# Altium project PCB_Project.PrjPcb
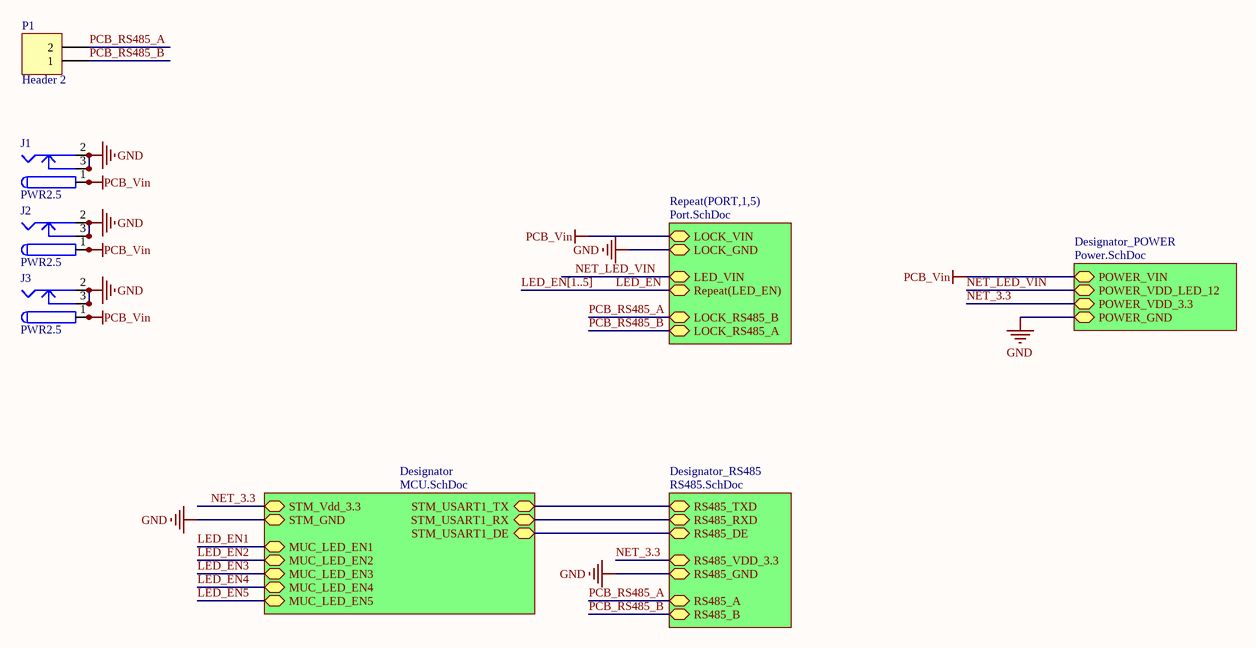
[diagram p0: Connect.SchDoc]
5 sheets, 120 parts. Net scope: strictly hierarchical (ports join the sheet entries above them; power ports are local).
Board file: PCB_CONNECT.PcbDoc
Sheets:
  Connect.SchDoc
    PORT1 = Port.SchDoc
    PORT2 = Port.SchDoc
    PORT3 = Port.SchDoc
    PORT4 = Port.SchDoc
    PORT5 = Port.SchDoc
    Designator_POWER = Power.SchDoc
    Designator_RS485 = RS485.SchDoc
    Designator = MCU.SchDoc

## Sheet Connect.SchDoc
size A4

### Parts
J1  PWR2.5  [KLD-0202]
J2  PWR2.5  [KLD-0202]
J3  PWR2.5  [KLD-0202]
P1  Header 2  [KF128-2P]

### Sub-sheets
Designator = MCU.SchDoc: STM_USART1_RX, STM_USART1_DE, STM_Vdd_3.3, STM_USART1_TX, STM_GND, MUC_LED_EN3, MUC_LED_EN2, MUC_LED_EN5, MUC_LED_EN1, MUC_LED_EN4
Designator_POWER = Power.SchDoc: POWER_GND, POWER_VDD_LED_12, POWER_VIN, POWER_VDD_3.3
Designator_RS485 = RS485.SchDoc: RS485_RXD, RS485_TXD, RS485_DE, RS485_VDD_3.3, RS485_B, RS485_GND, RS485_A
Repeat(PORT,1,5) = Port.SchDoc: LOCK_GND, Repeat(LED_EN), LOCK_RS485_B, LOCK_RS485_A, LOCK_VIN, LED_VIN

### Nets
GND: J1.2 J1.2A J1.2B J1.3 J1.3A J1.3B J2.2 J2.2A J2.2B J2.3 J2.3A J2.3B J3.2 J3.2A J3.2B J3.3 J3.3A J3.3B ; sheet Repeat(PORT,1,5)/LOCK_GND, sheet Designator_POWER/POWER_GND, sheet Designator_RS485/RS485_GND, sheet Designator/STM_GND  [project net Lock_GND]
NET_3.3: sheet Designator_POWER/POWER_VDD_3.3, sheet Designator_RS485/RS485_VDD_3.3, sheet Designator/STM_Vdd_3.3
NET_LED_VIN: sheet Repeat(PORT,1,5)/LED_VIN, sheet Designator_POWER/POWER_VDD_LED_12
PCB_Vin: J1.1 J1.1A J1.1B J2.1 J2.1A J2.1B J3.1 J3.1A J3.1B ; sheet Repeat(PORT,1,5)/LOCK_VIN, sheet Designator_POWER/POWER_VIN  [project net Lock_Vin]
DE: sheet Designator_RS485/RS485_DE, sheet Designator/STM_USART1_DE
LED_EN: sheet Repeat(PORT,1,5)/Repeat(LED_EN)
PCB_RS485_A: P1.2 ; sheet Repeat(PORT,1,5)/LOCK_RS485_B, sheet Designator_RS485/RS485_A  [project net Lock_RS485_B]
PCB_RS485_B: P1.1 ; sheet Repeat(PORT,1,5)/LOCK_RS485_A, sheet Designator_RS485/RS485_B  [project net Lock_RS485_A]
RXD: sheet Designator_RS485/RS485_RXD, sheet Designator/STM_USART1_RX
TXD: sheet Designator_RS485/RS485_TXD, sheet Designator/STM_USART1_TX

### Buses and harness runs
bus LED_EN[1..5]

### Library data of the parts
J1-J3 = PWR2.5: Low Voltage Power Supply Connector; Published: 17-Dec-2003; DatasheetDocument: 09-May-2002; Publisher: Altium Limited; ComponentLink1Description: Manufacturer Link; ComponentLink1URL: http://domino.kycon.com/internet/Products.html
P1 = Header 2: Header, 2-Pin; LatestRevisionDate: 17-Jul-2002; LatestRevisionNote: Re-released for DXP Platform.; Publisher: Altium Limited

## Sheet Port.SchDoc
size A4
Used 5 times, as channels PORT1, PORT2, PORT3, PORT4, PORT5. Parts and nets are listed once, with the designators drawn on the sheet.
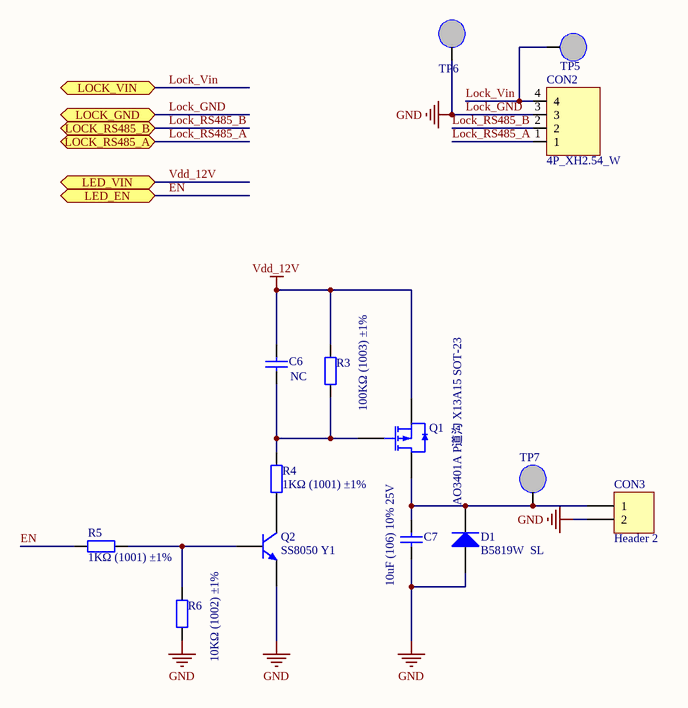
[diagram p1: Port.SchDoc]

### Parts
C6  NC  [0805_C]
C7  10uF (106) 10% 25V  [0805_C]
CON2  4P_XH2.54_W  [XH2.54-LS-4P]
CON3  Header 2  [PH2.0-LS-2P]
D1  B5819W  SL  [SOD-123]
Q1  AO3401A P道沟 X13A15 SOT-23  [SOT-23-3L]
Q2  SS8050 Y1  [SOT-23(SOT-23-3)]
R3  100KΩ (1003) ±1%  [0805_R]
R4  1KΩ (1001) ±1%  [0805_R]
R5  1KΩ (1001) ±1%  [0805_R]
R6  10KΩ (1002) ±1%  [0805_R]
TP5  TP  [TP]  (value not drawn)
TP6  TP  [TP]  (value not drawn)
TP7  TP  [TP]  (value not drawn)

### Ports
LED_EN, LED_VIN, LOCK_GND, LOCK_RS485_A, LOCK_RS485_B, LOCK_VIN

### Nets
Lock_GND: C7.1 CON2.3 CON3.2 D1.1(A) Q2.2(E) R6.1 TP6.1 ; port LOCK_GND  [also labelled GND]
Vdd_12V: C6.2 Q1.2(S) R3.2 ; port LED_VIN
EN: R5.1 ; port LED_EN
Lock_RS485_A: CON2.1 ; port LOCK_RS485_A
Lock_RS485_B: CON2.2 ; port LOCK_RS485_B
Lock_Vin: CON2.4 TP5.1 ; port LOCK_VIN
NetC6_1: C6.1 Q1.1(G) R3.1 R4.1
NetC7_2: C7.2 CON3.1 D1.2(K) Q1.3(D) TP7.1
NetQ2_1: Q2.1(B) R5.2 R6.2
NetQ2_3: Q2.3(C) R4.2

Not connected (* = marked no-connect by the designer): CON2 A B

### Channels
PORT1: designators end in _PORT1; ports LED_EN=EN LED_VIN=NET_LED_VIN LOCK_GND=Lock_GND LOCK_RS485_A=Lock_RS485_A LOCK_RS485_B=Lock_RS485_B LOCK_VIN=Lock_Vin
PORT2: designators end in _PORT2; ports LED_EN=EN LED_VIN=NET_LED_VIN LOCK_GND=Lock_GND LOCK_RS485_A=Lock_RS485_A LOCK_RS485_B=Lock_RS485_B LOCK_VIN=Lock_Vin
PORT3: designators end in _PORT3; ports LED_EN=EN LED_VIN=NET_LED_VIN LOCK_GND=Lock_GND LOCK_RS485_A=Lock_RS485_A LOCK_RS485_B=Lock_RS485_B LOCK_VIN=Lock_Vin
PORT4: designators end in _PORT4; ports LED_EN=EN LED_VIN=NET_LED_VIN LOCK_GND=Lock_GND LOCK_RS485_A=Lock_RS485_A LOCK_RS485_B=Lock_RS485_B LOCK_VIN=Lock_Vin
PORT5: designators end in _PORT5; ports LED_EN=EN LED_VIN=NET_LED_VIN LOCK_GND=Lock_GND LOCK_RS485_A=Lock_RS485_A LOCK_RS485_B=Lock_RS485_B LOCK_VIN=Lock_Vin

### Library data of the parts
C6 = 0805 22uF (226) 20% 25V: 贴片电容; ComponentLink1Description: 供应商链接; ComponentLink1URL: http://www.szlcsc.com/product/details_46786.html; Package: 0805; Supplier: LC; SuppliersPartNumber: C45783
C7 = 0805 10uF (106) 10% 25V: 贴片电容; ComponentLink1Description: 供应商链接; ComponentLink1URL: http://www.szlcsc.com/product/details_16532.html; Package: 0805; Supplier: LC; SuppliersPartNumber: C15850
CON3 = Header 2: Header, 2-Pin; LatestRevisionDate: 17-Jul-2002; LatestRevisionNote: Re-released for DXP Platform.; Publisher: Altium Limited
D1 = SOD-123 B5819W  SL: 肖特基二极管; ComponentLink1Description: 供应商链接; ComponentLink1URL: http://www.szlcsc.com/product/details_9093.html; Package: SOD-123; Supplier: LC; SuppliersPartNumber: C8598
Q1 = AO3401A P道沟 X13A15 SOT-23: MOS(场效应管); ComponentLink1Description: 供应商链接; ComponentLink1URL: http://www.szlcsc.com/product/details_15801.html; Package: SOT-23; Supplier: LC; SuppliersPartNumber: C15127
Q2 = SOT-23 SS8050 Y1: 三极管; ComponentLink1Description: 供应商链接; ComponentLink1URL: http://www.szlcsc.com/product/details_2507.html; Package: SOT-23; Supplier: LC; SuppliersPartNumber: C2150
R3 = 0805 100KΩ (1003) 1%: 贴片电阻; ComponentLink1Description: 供应商链接; ComponentLink1URL: http://www.szlcsc.com/product/details_18095.html; Package: 0805; Supplier: LC; SuppliersPartNumber: C17407
R4 R5 = 0805 1KΩ (1001) 1%: 贴片电阻; ComponentLink1Description: 供应商链接; ComponentLink1URL: http://www.szlcsc.com/product/details_18201.html; Package: 0805; Supplier: LC; SuppliersPartNumber: C17513
R6 = 0805 10KΩ (1002) 1%: 贴片电阻; ComponentLink1Description: 供应商链接; ComponentLink1URL: http://www.szlcsc.com/product/details_18102.html; Package: 0805; Supplier: LC; SuppliersPartNumber: C17414

## Sheet Power.SchDoc
size A4
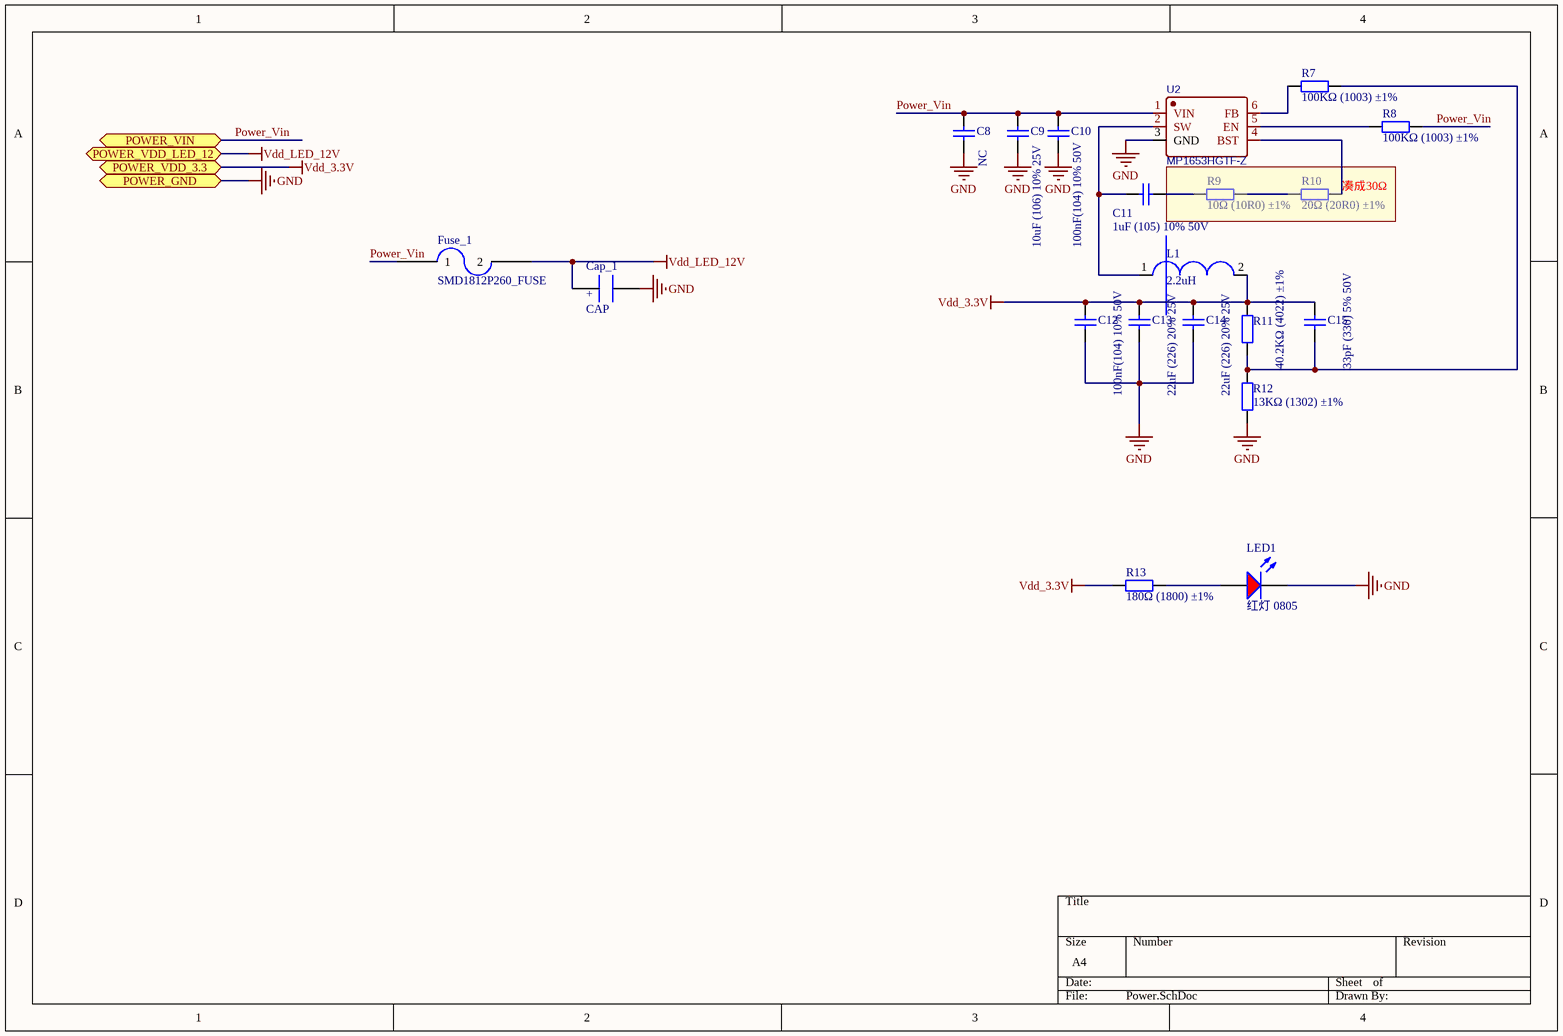
[diagram p2: Power.SchDoc]

### Parts
C8  NC  [0805_C]
C9  10uF (106) 10% 25V  [0805_C]
C10  100nF(104) 10% 50V  [0805_C]
C11  1uF (105) 10% 50V  [0805_C]
C12  100nF(104) 10% 50V  [0805_C]
C13  22uF (226) 20% 25V  [0805_C]
C14  22uF (226) 20% 25V  [0805_C]
C15  33pF (330) 5% 50V  [0805_C]
Cap_1  CAP  [8X12_CAP]
Fuse_1  SMD1812P260_FUSE  [SMD1812P260]
L1  2.2uH  [L_4030]
LED1  红灯 0805  [0805_LED_S1]
R7  100KΩ (1003) ±1%  [0805_R]
R8  100KΩ (1003) ±1%  [0805_R]
R9  10Ω (10R0) ±1%  [0805_R]
R10  20Ω (20R0) ±1%  [0805_R]
R11  40.2KΩ (4022) ±1%  [0805_R]
R12  13KΩ (1302) ±1%  [0805_R]
R13  180Ω (1800) ±1%  [0805_R]
U2  MP1653HGTF-Z  [SOT563-6]

### Blocks framed on the sheet
凑成30Ω: R9 R10

### Ports
POWER_GND, POWER_VDD_3.3, POWER_VDD_LED_12, POWER_VIN

### Nets
GND: C8.1 C9.1 C10.1 C12.1 C13.1 C14.1 Cap_1.2 LED1.K R12.1 U2.3(GND) ; port POWER_GND  [project net Lock_GND]
Power_Vin: C8.2 C9.2 C10.2 Fuse_1.1 R8.2 U2.1(VIN) ; port POWER_VIN  [project net Lock_Vin]
Vdd_3.3V: C12.2 C13.2 C14.2 C15.2 L1.2 R11.1 R13.1 ; port POWER_VDD_3.3  [project net NET_3.3]
Vdd_LED_12V: Cap_1.1 Fuse_1.2 ; port POWER_VDD_LED_12  [project net NET_LED_VIN]
NetC11_1: C11.1 R9.2
NetC11_2: C11.2 L1.1 U2.2(SW)
NetC15_1: C15.1 R7.2 R11.2 R12.2
NetLED1_A: LED1.A R13.2
NetR7_1: R7.1 U2.6(FB)
NetR8_1: R8.1 U2.5(EN)
NetR9_1: R9.1 R10.2
NetR10_1: R10.1 U2.4(BST)

### Notes on the sheet
- (in symbol CAP) +

### Library data of the parts
C8 C9 = 0805 10uF (106) 10% 25V: 贴片电容; ComponentLink1Description: 供应商链接; ComponentLink1URL: http://www.szlcsc.com/product/details_16532.html; Package: 0805; Supplier: LC; SuppliersPartNumber: C15850
C10 C12 = 0805 100nF(104) 10% 50V: 贴片电容; ComponentLink1Description: 供应商链接; ComponentLink1URL: http://www.szlcsc.com/product/details_50686.html; Package: 0805; Supplier: LC; SuppliersPartNumber: C49678
C11 = 0805 1uF (105) 10% 50V: 贴片电容; ComponentLink1Description: 供应商链接; ComponentLink1URL: http://www.szlcsc.com/product/details_29074.html; Package: 0805; Supplier: LC; SuppliersPartNumber: C28323
C13 C14 = 0805 22uF (226) 20% 25V: 贴片电容; ComponentLink1Description: 供应商链接; ComponentLink1URL: http://www.szlcsc.com/product/details_46786.html; Package: 0805; Supplier: LC; SuppliersPartNumber: C45783
C15 = 0805 33pF (330) 5% 50V: 贴片电容; ComponentLink1Description: 供应商链接; ComponentLink1URL: http://www.szlcsc.com/product/details_2166.html; Package: 0805; Supplier: LC; SuppliersPartNumber: C1814
L1 = 33uH
LED1 = 0805 红灯: 发光二极管; ComponentLink1Description: 供应商链接; ComponentLink1URL: http://www.szlcsc.com/product/details_2668.html; Package: 0805; Supplier: LC; SuppliersPartNumber: C2295
R7 R8 = 0805 100KΩ (1003) 1%: 贴片电阻; ComponentLink1Description: 供应商链接; ComponentLink1URL: http://www.szlcsc.com/product/details_18095.html; Package: 0805; Supplier: LC; SuppliersPartNumber: C17407
R9 = 0805 10Ω (10R0) 1%: 贴片电阻; ComponentLink1Description: 供应商链接; ComponentLink1URL: http://www.szlcsc.com/product/details_18103.html; Package: 0805; Supplier: LC; SuppliersPartNumber: C17415
R10 = 0805 20Ω (20R0) 1%: 贴片电阻; ComponentLink1Description: 供应商链接; ComponentLink1URL: http://www.szlcsc.com/product/details_18232.html; Package: 0805; Supplier: LC; SuppliersPartNumber: C17544
R11 = 0805 40.2KΩ (4022) 1%: 贴片电阻; ComponentLink1Description: 供应商链接; ComponentLink1URL: http://www.szlcsc.com/product/details_18366.html; Package: 0805; Supplier: LC; SuppliersPartNumber: C17678
R12 = 0805 13KΩ (1302) 1%: 贴片电阻; ComponentLink1Description: 供应商链接; ComponentLink1URL: http://www.szlcsc.com/product/details_18143.html; Package: 0805; Supplier: LC; SuppliersPartNumber: C17455
R13 = 0805 180Ω (1800) 1%: 贴片电阻; ComponentLink1Description: 供应商链接; ComponentLink1URL: http://www.szlcsc.com/product/details_26013.html; Package: 0805; Supplier: LC; SuppliersPartNumber: C25270
U2 = MP1653HGTF-Z: BOM_Manufacturer: MPS; BOM_Supplier: LCSC; BOM_Manufacturer Part: MP1653HGTF-Z; BOM_Supplier Part: C132613; spicePre: U

## Sheet RS485.SchDoc
size A4
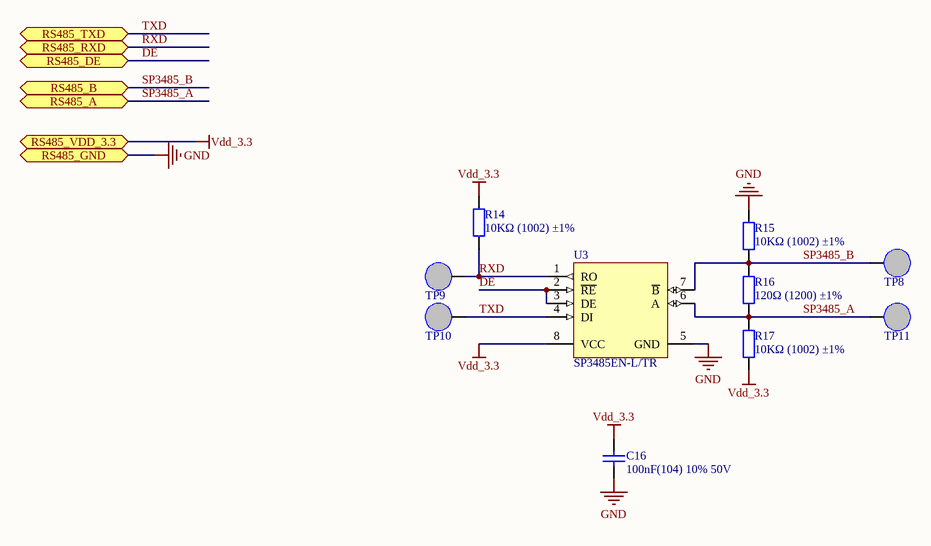
[diagram p3: RS485.SchDoc]

### Parts
C16  100nF(104) 10% 50V  [0805_C]
R14  10KΩ (1002) ±1%  [0805_R]
R15  10KΩ (1002) ±1%  [0805_R]
R16  120Ω (1200) ±1%  [0805_R]
R17  10KΩ (1002) ±1%  [0805_R]
TP8  TP  [TP]  (value not drawn)
TP9  TP  [TP]  (value not drawn)
TP10  TP  [TP]  (value not drawn)
TP11  TP  [TP]  (value not drawn)
U3  SP3485EN-L/TR  [SOIC-8_150mil]

### Ports
RS485_A, RS485_B, RS485_DE, RS485_GND, RS485_RXD, RS485_TXD, RS485_VDD_3.3

### Nets
GND: C16.2 R15.2 U3.5(GND) ; port RS485_GND  [project net Lock_GND]
Vdd_3.3: C16.1 R14.2 R17.1 U3.8(VCC) ; port RS485_VDD_3.3  [project net NET_3.3]
DE: U3.2(~{RE}) U3.3(DE) ; port RS485_DE
RXD: R14.1 TP9.1 U3.1(RO) ; port RS485_RXD
SP3485_A: R16.1 R17.2 TP11.1 U3.6(A) ; port RS485_A  [project net Lock_RS485_B]
SP3485_B: R15.1 R16.2 TP8.1 U3.7(~{B}) ; port RS485_B  [project net Lock_RS485_A]
TXD: TP10.1 U3.4(DI) ; port RS485_TXD

### Library data of the parts
C16 = 0805 100nF(104) 10% 50V: 贴片电容; ComponentLink1Description: 供应商链接; ComponentLink1URL: http://www.szlcsc.com/product/details_50686.html; Package: 0805; Supplier: LC; SuppliersPartNumber: C49678
R14 R15 R17 = 0805 10KΩ (1002) 1%: 贴片电阻; ComponentLink1Description: 供应商链接; ComponentLink1URL: http://www.szlcsc.com/product/details_18102.html; Package: 0805; Supplier: LC; SuppliersPartNumber: C17414
R16 = 0805 120Ω (1200) 1%: 贴片电阻; ComponentLink1Description: 供应商链接; ComponentLink1URL: http://www.szlcsc.com/product/details_18125.html; Package: 0805; Supplier: LC; SuppliersPartNumber: C17437
U3 = SP3485EN-L/TR_[C8963]: RS-485/RS-422; ComponentLink1Description: 供应商链接; ComponentLink1URL: http://www.szlcsc.com/product/details_9482.html; Package: SOIC-8; Supplier: LC; SuppliersPartNumber: C8963

## Sheet MCU.SchDoc
size A4
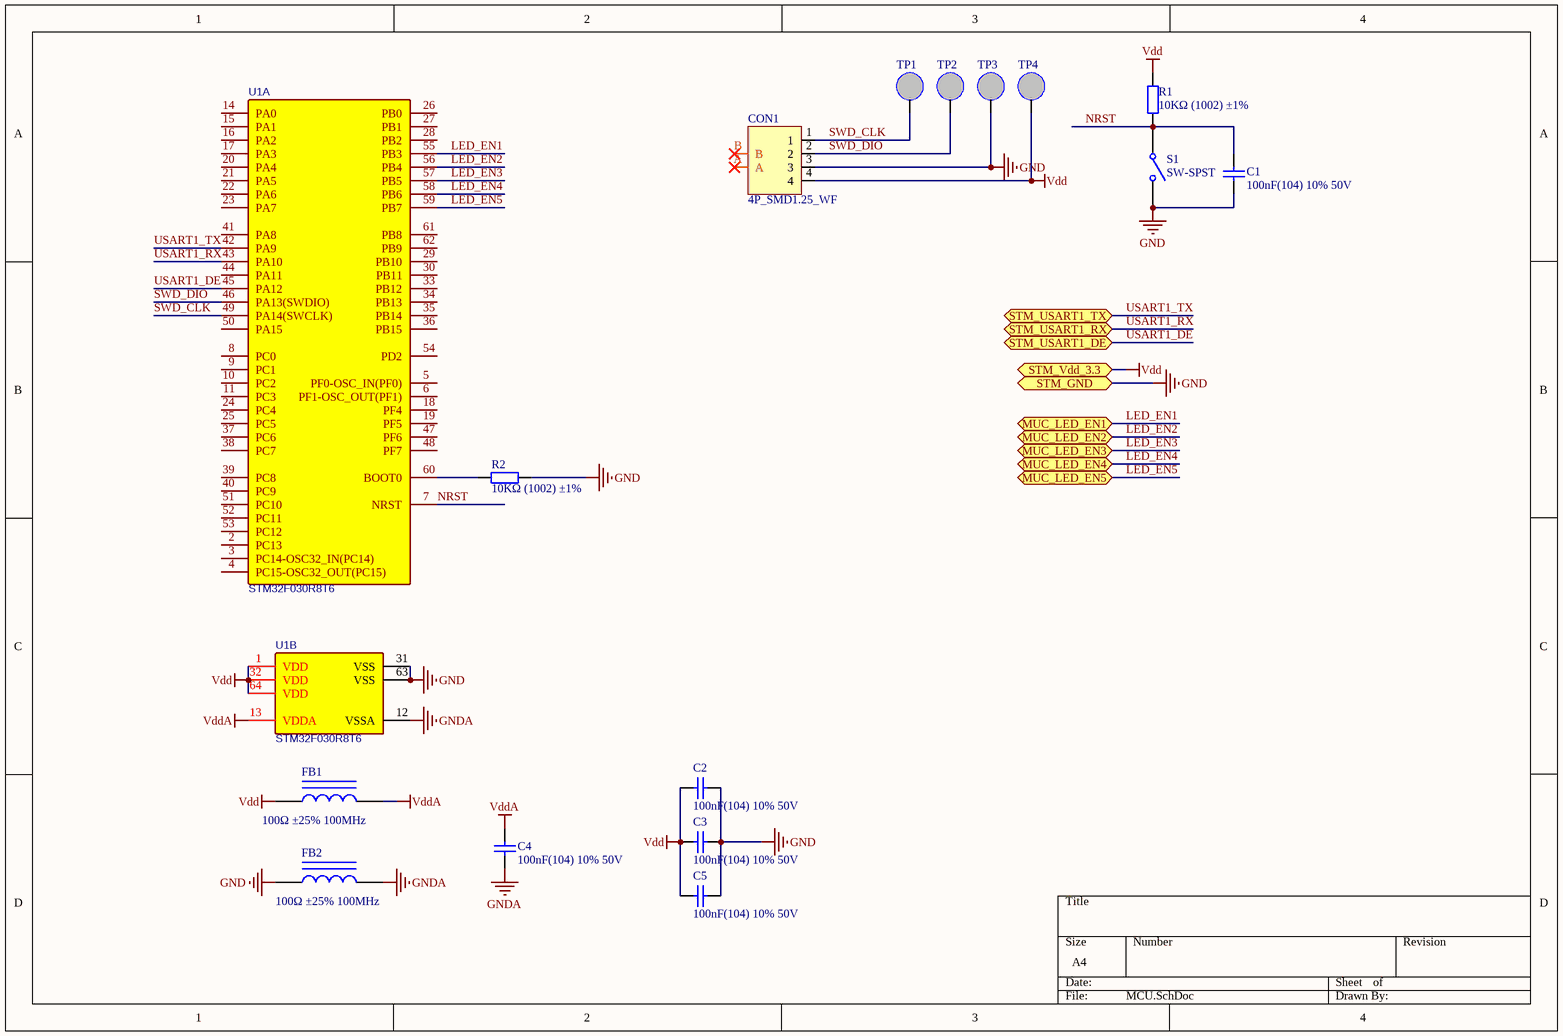
[diagram p4: MCU.SchDoc]

### Parts
C1  100nF(104) 10% 50V  [0805_C]
C2  100nF(104) 10% 50V  [0805_C]
C3  100nF(104) 10% 50V  [0805_C]
C4  100nF(104) 10% 50V  [0805_C]
C5  100nF(104) 10% 50V  [0805_C]
CON1  4P_SMD1.25_WF  [MX 1.25-LS-4P]
FB1  100Ω ±25% 100MHz  [0805_L]
FB2  100Ω ±25% 100MHz  [0805_L]
R1  10KΩ (1002) ±1%  [0805_R]
R2  10KΩ (1002) ±1%  [0805_R]
S1  SW-SPST  [key]
TP1  TP  [TP]  (value not drawn)
TP2  TP  [TP]  (value not drawn)
TP3  TP  [TP]  (value not drawn)
TP4  TP  [TP]  (value not drawn)
U1  STM32F030R8T6  [LQFP-64_10X10X05P]  (parts A,B of 2)

### Ports
MUC_LED_EN1, MUC_LED_EN2, MUC_LED_EN3, MUC_LED_EN4, MUC_LED_EN5, STM_GND, STM_USART1_DE, STM_USART1_RX, STM_USART1_TX, STM_Vdd_3.3

### Nets
GND: C1.1 C2.1 C3.1 C5.1 CON1.3 FB2.1 R2.2 S1.2(NO) TP3.1 U1.31(VSS) U1.63(VSS) ; port STM_GND  [project net Lock_GND]
GNDA: C4.1 FB2.2 U1.12(VSSA)
Vdd: C2.2 C3.2 C5.2 CON1.4 FB1.1 R1.2 TP4.1 U1.1(VDD) U1.32(VDD) U1.64(VDD) ; port STM_Vdd_3.3  [project net NET_3.3]
VddA: C4.2 FB1.2 U1.13(VDDA)
LED_EN1: U1.55(PB3) ; port MUC_LED_EN1  [project net EN]
LED_EN2: U1.56(PB4) ; port MUC_LED_EN2  [project net EN]
LED_EN3: U1.57(PB5) ; port MUC_LED_EN3  [project net EN]
LED_EN4: U1.58(PB6) ; port MUC_LED_EN4  [project net EN]
LED_EN5: U1.59(PB7) ; port MUC_LED_EN5  [project net EN]
NRST: C1.2 R1.1 S1.1(COMMON) U1.7(NRST)
SWD_CLK: CON1.1 TP1.1 U1.49(PA14(SWCLK))
SWD_DIO: CON1.2 TP2.1 U1.46(PA13(SWDIO))
USART1_DE: U1.45(PA12) ; port STM_USART1_DE  [project net DE]
USART1_RX: U1.43(PA10) ; port STM_USART1_RX  [project net RXD]
USART1_TX: U1.42(PA9) ; port STM_USART1_TX  [project net TXD]
NetR2_1: R2.1 U1.60(BOOT0)

Not connected (* = marked no-connect by the designer): CON1 A* B*; U1 2(PC13) 3(PC14-OSC32_IN(PC14)) 4(PC15-OSC32_OUT(PC15)) 5(PF0-OSC_IN(PF0)) 6(PF1-OSC_OUT(PF1)) 8(PC0) 9(PC1) 10(PC2) 11(PC3) 14(PA0) 15(PA1) 16(PA2) 17(PA3) 18(PF4) 19(PF5) 20(PA4) 21(PA5) 22(PA6) 23(PA7) 24(PC4) 25(PC5) 26(PB0) 27(PB1) 28(PB2) 29(PB10) 30(PB11) 33(PB12) 34(PB13) 35(PB14) 36(PB15) 37(PC6) 38(PC7) 39(PC8) 40(PC9) 41(PA8) 44(PA11) 47(PF6) 48(PF7) 50(PA15) 51(PC10) 52(PC11) 53(PC12) 54(PD2) 61(PB8) 62(PB9)

### Library data of the parts
C1-C5 = 0805 100nF(104) 10% 50V: 贴片电容; ComponentLink1Description: 供应商链接; ComponentLink1URL: http://www.szlcsc.com/product/details_50686.html; Package: 0805; Supplier: LC; SuppliersPartNumber: C49678
CON1 = 4P_XH2.54_W
FB1 FB2 = 0805 100Ω 25% 100MHz: 贴片磁珠; ComponentLink1Description: 供应商链接; ComponentLink1URL: http://www.szlcsc.com/product/details_1367.html; Package: 0805; Supplier: LC; SuppliersPartNumber: C1015
R1 R2 = 0805 10KΩ (1002) 1%: 贴片电阻; ComponentLink1Description: 供应商链接; ComponentLink1URL: http://www.szlcsc.com/product/details_18102.html; Package: 0805; Supplier: LC; SuppliersPartNumber: C17414
S1 = SW-SPST: Single-Pole, Single-Throw Switch; Published: 24-Mar-1999; LatestRevisionDate: 17-Jul-2002; LatestRevisionNote: Re-released for DXP Platform.; PackageReference: SPST-2; Publisher: Altium Limited; PackageDescription: Switch; 2 Leads
U1 = STM32F030R8T6: BOM_Manufacturer: ST; subpart_no: 1; tags: STM32; BOM_Supplier Part: C39105; BOM_Supplier: LCSC; BOM_Manufacturer Part: STM32F030R8T6; image: http://image.lceda.cn/szlcsc/C39105.jpg; spicePre: U

## Nets that join several sheets
Lock_GND: Connect (18 pins), PORT1 (7 pins), PORT2 (7 pins), PORT3 (7 pins), PORT4 (7 pins), PORT5 (7 pins), Power (10 pins), RS485 (C16.2 R15.2 U3.5), MCU (11 pins)
Lock_Vin: Connect (9 pins), PORT1 (CON2_PORT1.4 TP5_PORT1.1), PORT2 (CON2_PORT2.4 TP5_PORT2.1), PORT3 (CON2_PORT3.4 TP5_PORT3.1), PORT4 (CON2_PORT4.4 TP5_PORT4.1), PORT5 (CON2_PORT5.4 TP5_PORT5.1), Power (6 pins)
NET_3.3: Power (7 pins), RS485 (C16.1 R14.2 R17.1 U3.8), MCU (10 pins)
NET_LED_VIN: PORT1 (C6_PORT1.2 Q1_PORT1.2 R3_PORT1.2), PORT2 (C6_PORT2.2 Q1_PORT2.2 R3_PORT2.2), PORT3 (C6_PORT3.2 Q1_PORT3.2 R3_PORT3.2), PORT4 (C6_PORT4.2 Q1_PORT4.2 R3_PORT4.2), PORT5 (C6_PORT5.2 Q1_PORT5.2 R3_PORT5.2), Power (Cap_1.1 Fuse_1.2)
DE: RS485 (U3.2 U3.3), MCU (U1.45)
EN: PORT1 (R5_PORT1.1), MCU (U1.55)
EN: PORT2 (R5_PORT2.1), MCU (U1.56)
EN: PORT3 (R5_PORT3.1), MCU (U1.57)
EN: PORT4 (R5_PORT4.1), MCU (U1.58)
EN: PORT5 (R5_PORT5.1), MCU (U1.59)
Lock_RS485_A: Connect (P1.1), PORT1 (CON2_PORT1.1), PORT2 (CON2_PORT2.1), PORT3 (CON2_PORT3.1), PORT4 (CON2_PORT4.1), PORT5 (CON2_PORT5.1), RS485 (R15.1 R16.2 TP8.1 U3.7)
Lock_RS485_B: Connect (P1.2), PORT1 (CON2_PORT1.2), PORT2 (CON2_PORT2.2), PORT3 (CON2_PORT3.2), PORT4 (CON2_PORT4.2), PORT5 (CON2_PORT5.2), RS485 (R16.1 R17.2 TP11.1 U3.6)
RXD: RS485 (R14.1 TP9.1 U3.1), MCU (U1.43)
TXD: RS485 (TP10.1 U3.4), MCU (U1.42)